# Altium project RGB_PCB.PrjPcb
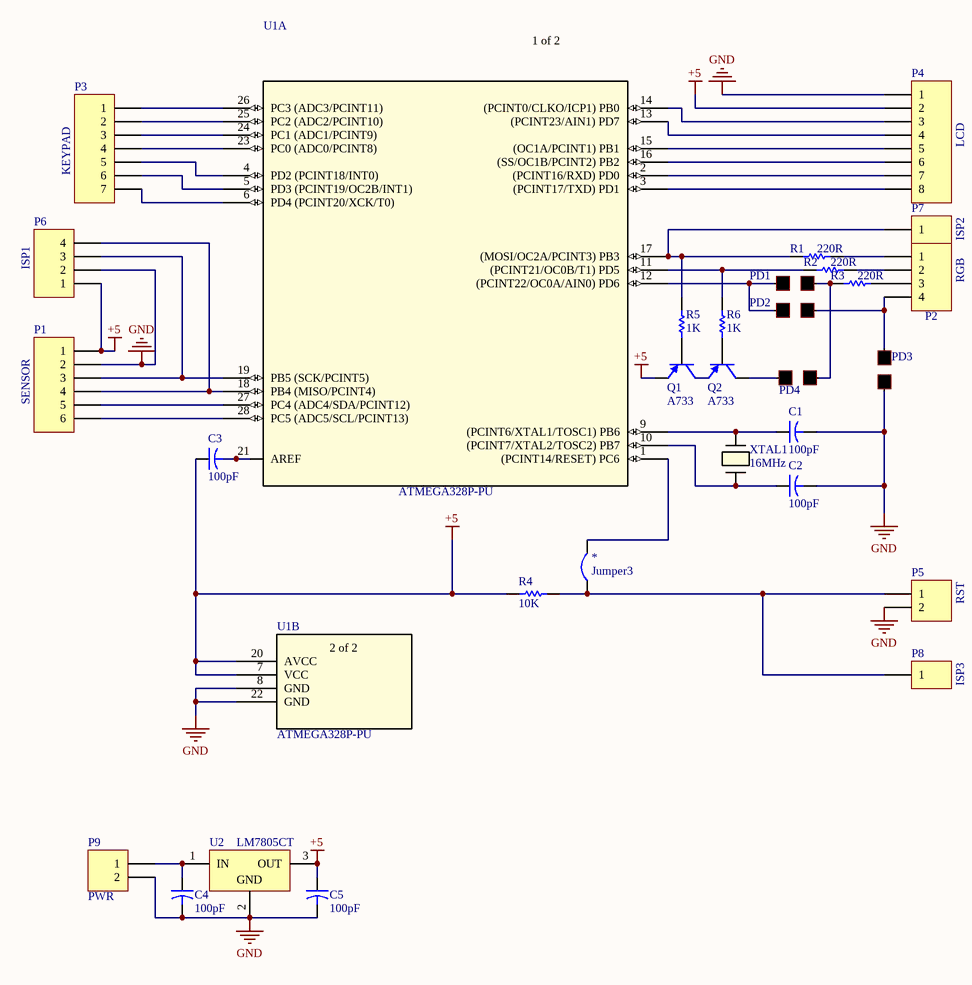
[diagram p0: Sheet1.SchDoc]
2 sheets, 39 parts. Net scope: global (net labels, ports and power ports of the same name join across sheets).
Board file: PCB1.PcbDoc
Sheets:
  Sheet1.SchDoc
  single-pwm.SchDoc

## Sheet Sheet1.SchDoc: RGB Color Sensor
size Letter; DrawnBy: Group 2; SheetNumber: 1; SheetTotal: 1

### Parts
*  Jumper3  [JUMPER3]
C1  100pF  [CAP1]
C2  100pF  [CAP1]
C3  100pF  [CAP1]
C4  100pF  [CAP1]
C5  100pF  [CAP1]
P1  SENSOR  [H6]
P2  RGB  [H4]
P3  KEYPAD  [H7]
P4  LCD  [H8]
P5  RST  [H2]
P6  ISP1  [H4]
P7  ISP2  [H1]
P8  ISP3  [H1]
P9  PWR  [H2_PWR]
PD1  Pad2  [PAD2]  (value not drawn)
PD2  Pad2  [PAD2]  (value not drawn)
PD3  Pad2  [PAD2]  (value not drawn)
PD4  Pad2  [PAD2]  (value not drawn)
Q1  A733  [TO-92_ONS]
Q2  A733  [TO-92_ONS]
R1  220R  [RES]
R2  220R  [RES]
R3  220R  [RES]
R4  10K  [RES]
R5  1K  [RES]
R6  1K  [RES]
U1  ATMEGA328P-PU  [28P3_ATM]  (parts A,B of 2)
U2  LM7805CT  [FAIR-TO-220-3]
XTAL1  16MHz  [XTAL_9B_TXC]

### Nets
+5: C3.1 C5.1 P1.1 P4.2 P6.1 Q1.1(E) R4.2 U1.7(VCC) U1.20(AVCC) U2.3(OUT)
GND: C1.2 C2.2 C4.2 C5.2 P1.2 P4.1 P5.2 P6.2 P9.2 PD3.1 U1.8(GND) U1.22(GND) U2.2(GND)
Net*_1: *.1 P5.1 P8.1 R4.1
Net*_2: *.2 U1.1((PCINT14/RESET)_PC6)
NetC1_1: C1.1 U1.9((PCINT6/XTAL1/TOSC1)_PB6) XTAL1.2
NetC2_1: C2.1 U1.10((PCINT7/XTAL2/TOSC2)_PB7) XTAL1.1
NetC3_2: C3.2 U1.21(AREF)
NetC4_1: C4.1 P9.1 U2.1(IN)
NetP1_3: P1.3 P6.3 U1.19(PB5_(SCK/PCINT5))
NetP1_4: P1.4 P6.4 U1.18(PB4_(MISO/PCINT4))
NetP1_5: P1.5 U1.27(PC4_(ADC4/SDA/PCINT12))
NetP1_6: P1.6 U1.28(PC5_(ADC5/SCL/PCINT13))
NetP2_1: P2.1 R1.2
NetP2_2: P2.2 R2.2
NetP2_3: P2.3 R3.2
NetP2_4: P2.4 PD2.2 PD3.2
NetP3_1: P3.1 U1.26(PC3_(ADC3/PCINT11))
NetP3_2: P3.2 U1.25(PC2_(ADC2/PCINT10))
NetP3_3: P3.3 U1.24(PC1_(ADC1/PCINT9))
NetP3_4: P3.4 U1.23(PC0_(ADC0/PCINT8))
NetP3_5: P3.5 U1.4(PD2_(PCINT18/INT0))
NetP3_6: P3.6 U1.5(PD3_(PCINT19/OC2B/INT1))
NetP3_7: P3.7 U1.6(PD4_(PCINT20/XCK/T0))
NetP4_3: P4.3 U1.14((PCINT0/CLKO/ICP1)_PB0)
NetP4_4: P4.4 U1.13((PCINT23/AIN1)_PD7)
NetP4_5: P4.5 U1.15((OC1A/PCINT1)_PB1)
NetP4_6: P4.6 U1.16((SS/OC1B/PCINT2)_PB2)
NetP4_7: P4.7 U1.2((PCINT16/RXD)_PD0)
NetP4_8: P4.8 U1.3((PCINT17/TXD)_PD1)
NetP7_1: P7.1 R1.1 R5.2 U1.17((MOSI/OC2A/PCINT3)_PB3)
NetPD1_1: PD1.1 PD2.1 U1.12((PCINT22/OC0A/AIN0)_PD6)
NetPD1_2: PD1.2 PD4.1 R3.1
NetPD4_2: PD4.2 Q2.2(C)
NetQ1_2: Q1.2(C) Q2.1(E)
NetQ1_3: Q1.3(B) R5.1
NetQ2_3: Q2.3(B) R6.1
NetR2_1: R2.1 R6.2 U1.11((PCINT21/OC0B/T1)_PD5)

### Notes on the sheet
- (in symbol ATMEGA328P-PU, part A) 1 of 2
- (in symbol ATMEGA328P-PU, part B) 2 of 2

### Library data of the parts
C1-C5 = Cap1: Capacitor; Published: 23-Sep-2002; PackageReference: CAPR5-4X5; Publisher: Altium Limited; PackageDescription: Capacitor; 2 Leads; Value: 100pF
P1 = Header 6: Header, 6-Pin; LatestRevisionDate: 17-Jul-2002; LatestRevisionNote: Re-released for DXP Platform.; Publisher: Altium Limited
P2 P6 = Header 4: Header, 4-Pin; LatestRevisionDate: 17-Jul-2002; LatestRevisionNote: Re-released for DXP Platform.; Publisher: Altium Limited
P3 = Header 7: Header, 7-Pin; LatestRevisionDate: 17-Jul-2002; LatestRevisionNote: Re-released for DXP Platform.; Publisher: Altium Limited
P4 = Header 8: Header, 8-Pin; LatestRevisionDate: 17-Jul-2002; LatestRevisionNote: Re-released for DXP Platform.; Publisher: Altium Limited
P5 P9 = Header 2: Header, 2-Pin; LatestRevisionDate: 17-Jul-2002; LatestRevisionNote: Re-released for DXP Platform.; Publisher: Altium Limited
P7 P8 = Header 1: Header, 1-Pin; LatestRevisionDate: 17-Jul-2002; LatestRevisionNote: Re-released for DXP Platform.; Publisher: Altium Limited
PD1-PD4 = Pad2: Square Pad; h: 10mil
Q1 Q2 = A733: PNP General Purpose Transistor; Published: 8-Jun-2000; LatestRevisionDate: 15-Jan-2003; LatestRevisionNote: PCB Footprint 'BCY-W3/D4.7' replaced; DatasheetVersion: 1997; PackageVersion: Sep-1998; PackageReference: TO-92A; Publisher: Altium Limited; PackageDescription: TO, Flat Index; 3 In-Line, Axial Leads; Body Dia. 4.5mm; Leads 0.51 x 0.48 mm (max); ComponentLink1Description: Manufacturer Link; ComponentLink1URL: http://www.fairchildsemi.com/; ComponentLink2Description: Datasheet; ComponentLink2URL: http://www.fairchildsemi.com/ds/2N%2F2N3906.pdf
R1-R6 = Res1: Resistor; Published: 8-Jun-2000; LatestRevisionDate: 17-Jul-2002; LatestRevisionNote: Re-released for DXP Platform.; PackageReference: AXIAL-0.3; Publisher: Altium Limited; PackageDescription: Axial Device, Thru-Hole; 2 Leads; 0.3 in Pin Spacing
  R1-R3: Value: 220R
  R4: Value: 10K
  R5 R6: Value: 1K
U1 = ATMEGA328P-PU: No Description Available; Built_By: EMA_UL_Team; Vendor: Atmel; SourceLibrary: Atmel_2011-04-02; Manufacturer_Part_Number: ATMEGA328P-PU; Copyright: Copyright (C) 2018 Accelerated Designs. All rights reserved; RefDes: RefDes; Type: DEV
U2 = CMP-2000-04938-1: Positive Voltage Regulator, 5 V, 1 A, -40 to 125 degC, 3-Pin TO-220, RoHS, Tube; Manufacturer: FairchildSemiconductor; Maximum Input Voltage: 35V; Maximum Quiescent Current: 8mA; Load Regulation: 100mV; Maximum Output Current: 2.2(Typ)A; Output Type: Fixed; Typical Dropout Voltage @ Current: 2@1AV; Rad Hard: No; Output Voltage: 5V; Accuracy: ±4%; Number of Outputs: 1; Category: LinearRegulator; Package Description: 3-Pin Through Hole Device, Body 10 x 4.5 mm, Pitch 2.54 mm; Packaging: Rail/Tube; Mounting: ThroughHole; Polarity: Positive; Manufacturer URL: https://www.fairchildsemi.com/; Line Regulation: 100mV; Datasheet Version: Aug-12; Datasheet URL: https://datasheet.ciiva.com/26904/lm7805ct-26904988.pdf; Package Reference: TO-220; Package URL: https://www.fairchildsemi.com/package-drawings/TO/TO220B03.pdf; Package: 3TO-220AB; Operating Temperature: -40to125degC; Type: Linear
XTAL1 = 9B-11.0592MAAJ-B: No Description Available; Vendor: TXC; Built_By: EMA_Cory; SourceLibrary: TXC_2020-02-10; Datasheet: http://www.txccrystal.com/images/pdf/9b.pdf; Manufacturer_Part_Number: 9B-11.0592MAAJ-B; Copyright: Copyright (C) 2018 Accelerated Designs. All rights reserved; RefDes: RefDes; Type: DEV; Value: 16MHz

## Sheet single-pwm.SchDoc
size Letter; SheetNumber: 2; SheetTotal: 2
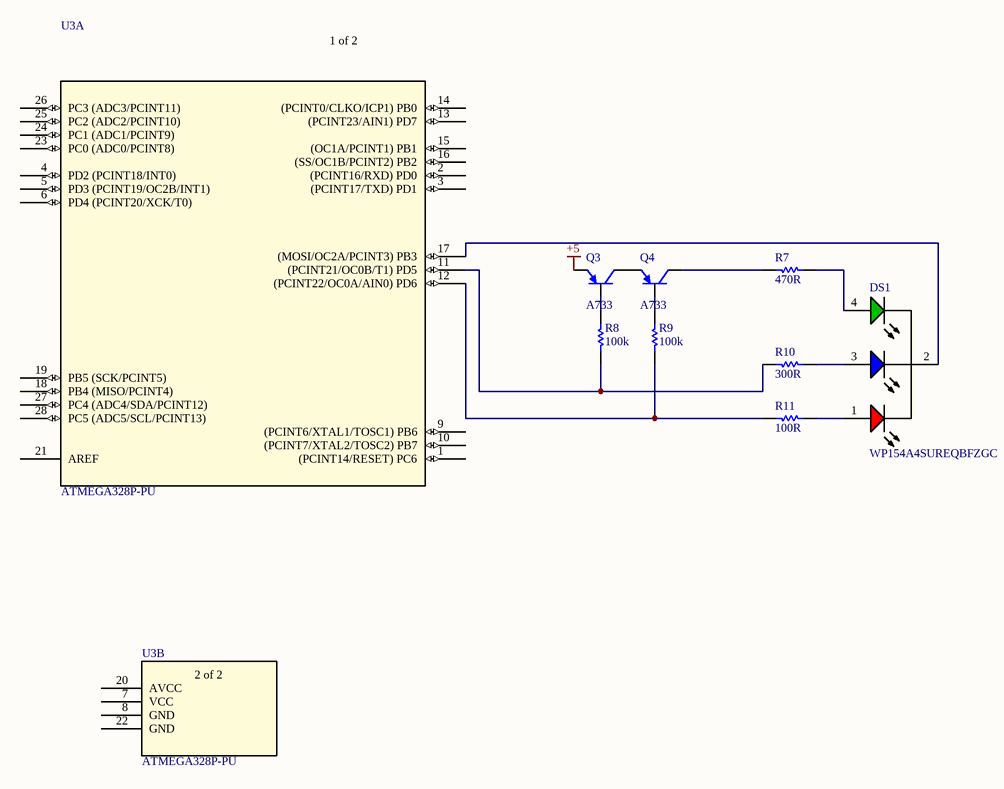
[diagram p1: single-pwm.SchDoc]

### Parts
DS1  WP154A4SUREQBFZGC  [KING-WP154A4SUREQBFZGC_V]
Q3  A733  [TO-92_ONS]
Q4  A733  [TO-92_ONS]
R7  470R  [RES_TOP_1]
R8  100k  [RES_TOP_1]
R9  100k  [RES_TOP_1]
R10  300R  [RES_TOP_1]
R11  100R  [RES_TOP_1]
U3  ATMEGA328P-PU  [28P3_ATM]  (parts A,B of 2)

### Nets
+5: Q3.1(E)
NetDS1_1: DS1.1(RED) R11.2
NetDS1_2: DS1.2(CATHODE) U3.17((MOSI/OC2A/PCINT3)_PB3)
NetDS1_3: DS1.3(BLUE) R10.2
NetDS1_4: DS1.4(GREEN) R7.2
NetQ3_2: Q3.2(C) Q4.1(E)
NetQ3_3: Q3.3(B) R8.2
NetQ4_2: Q4.2(C) R7.1
NetQ4_3: Q4.3(B) R9.2
NetR8_1: R8.1 R10.1 U3.11((PCINT21/OC0B/T1)_PD5)
NetR9_1: R9.1 R11.1 U3.12((PCINT22/OC0A/AIN0)_PD6)

Not connected (* = marked no-connect by the designer): U3 1((PCINT14/RESET)_PC6) 2((PCINT16/RXD)_PD0) 3((PCINT17/TXD)_PD1) 4(PD2_(PCINT18/INT0)) 5(PD3_(PCINT19/OC2B/INT1)) 6(PD4_(PCINT20/XCK/T0)_) 7(VCC) 8(GND) 9((PCINT6/XTAL1/TOSC1)_PB6) 10((PCINT7/XTAL2/TOSC2)_PB7) 13((PCINT23/AIN1)_PD7) 14((PCINT0/CLKO/ICP1)_PB0) 15((OC1A/PCINT1)_PB1) 16((SS/OC1B/PCINT2)_PB2) 18(PB4_(MISO/PCINT4)) 19(PB5_(SCK/PCINT5)) 20(AVCC) 21(AREF) 22(GND) 23(PC0_(ADC0/PCINT8)) 24(PC1_(ADC1/PCINT9)) 25(PC2_(ADC2/PCINT10)) 26(PC3_(ADC3/PCINT11)) 27(PC4_(ADC4/SDA/PCINT12)) 28(PC5_(ADC5/SCL/PCINT13))

### Notes on the sheet
- (in symbol ATMEGA328P-PU, part A) 1 of 2
- (in symbol ATMEGA328P-PU, part B) 2 of 2

### Library data of the parts
DS1 = CMP-2000-07415-1: Full Color LED Lamp, Dominant Wavelength RGB 630 / 525 / 465 nm, -40 to 85 degC, 4-Pin THD, RoHS; Manufacturer: Kingbright; Viewing Angle: 50°; Wavelength - Dominant: 630nm,525nm,465nm; Online Catalog: 5mm,T-13/4(RGB)RoundwithDomedTopLEDLamp; Millicandela Rating: 1300mcdRed,1700mcdGreen,900mcdBlue; Other Names: 754-1615 / WP154A4SUREQBFZGC-ND; Current - Test: 20mA; Wavelength - Peak: 645nm,515nm,460nm; Color: Red,Green,Blue(RGB); Voltage - Forward (Vf) (Typ): 1.9VRed,3.3VGreen,3.3VBlue; Lens Type: Clear; 3D Model: WP154A4SUREQBFZGW.sldprt / WP154A4SUREQBFZGW.pro / WP154A4SUREQBFZGW.igs / WP154A4SUREQBFZGW.stp; Lens Style/Size: RoundwithDomedTop,5mm,T-13/4; Packaging: Bulk; Datasheet URL: https://www.kingbrightusa.com/images/catalog/spec/WP154A4SUREQBFZGC.pdf; Family: LEDIndication-Discrete; Datasheet Version: Rev. 5A, 08/2014; Category: Optoelectronics; Manufacturer URL: http://www.kingbright.com/; Height: 8.60mm; Mounting Type: ThroughHole; Package Reference: WP154A4SUREQBFZGC; Mounting Technology: ThroughHole; Package Description: 4-Pin Through Hole LED, Dia 5.9 mm, Pitch 1.27 mm; Standard Package: 500; Package / Case: Radial-4Leads
Q3 Q4 = A733: PNP General Purpose Transistor; Published: 8-Jun-2000; LatestRevisionDate: 15-Jan-2003; LatestRevisionNote: PCB Footprint 'BCY-W3/D4.7' replaced; DatasheetVersion: 1997; PackageVersion: Sep-1998; PackageReference: TO-92A; Publisher: Altium Limited; PackageDescription: TO, Flat Index; 3 In-Line, Axial Leads; Body Dia. 4.5mm; Leads 0.51 x 0.48 mm (max); ComponentLink1Description: Manufacturer Link; ComponentLink1URL: http://www.fairchildsemi.com/; ComponentLink2Description: Datasheet; ComponentLink2URL: http://www.fairchildsemi.com/ds/2N%2F2N3906.pdf
R7-R11 = Res1: Resistor; Published: 8-Jun-2000; LatestRevisionDate: 17-Jul-2002; LatestRevisionNote: Re-released for DXP Platform.; PackageReference: AXIAL-0.3; Publisher: Altium Limited; PackageDescription: Axial Device, Thru-Hole; 2 Leads; 0.3 in Pin Spacing
  R7: Value: 470R
  R8 R9: Value: 100k
  R10: Value: 300R
  R11: Value: 100R
U3 = ATMEGA328P-PU: as U1 on sheet Sheet1; Manufacturer_Part_Number: ATMEGA328P-PU; Copyright: Copyright (C) 2018 Accelerated Designs. All rights reserved; RefDes: RefDes; Type: DEV

## Nets that join several sheets
+5: Sheet1 (10 pins), single-pwm (Q3.1)